# Altium schematic sheet Chua.SchDoc
size A4; SheetNumber: 2; SheetTotal: 9
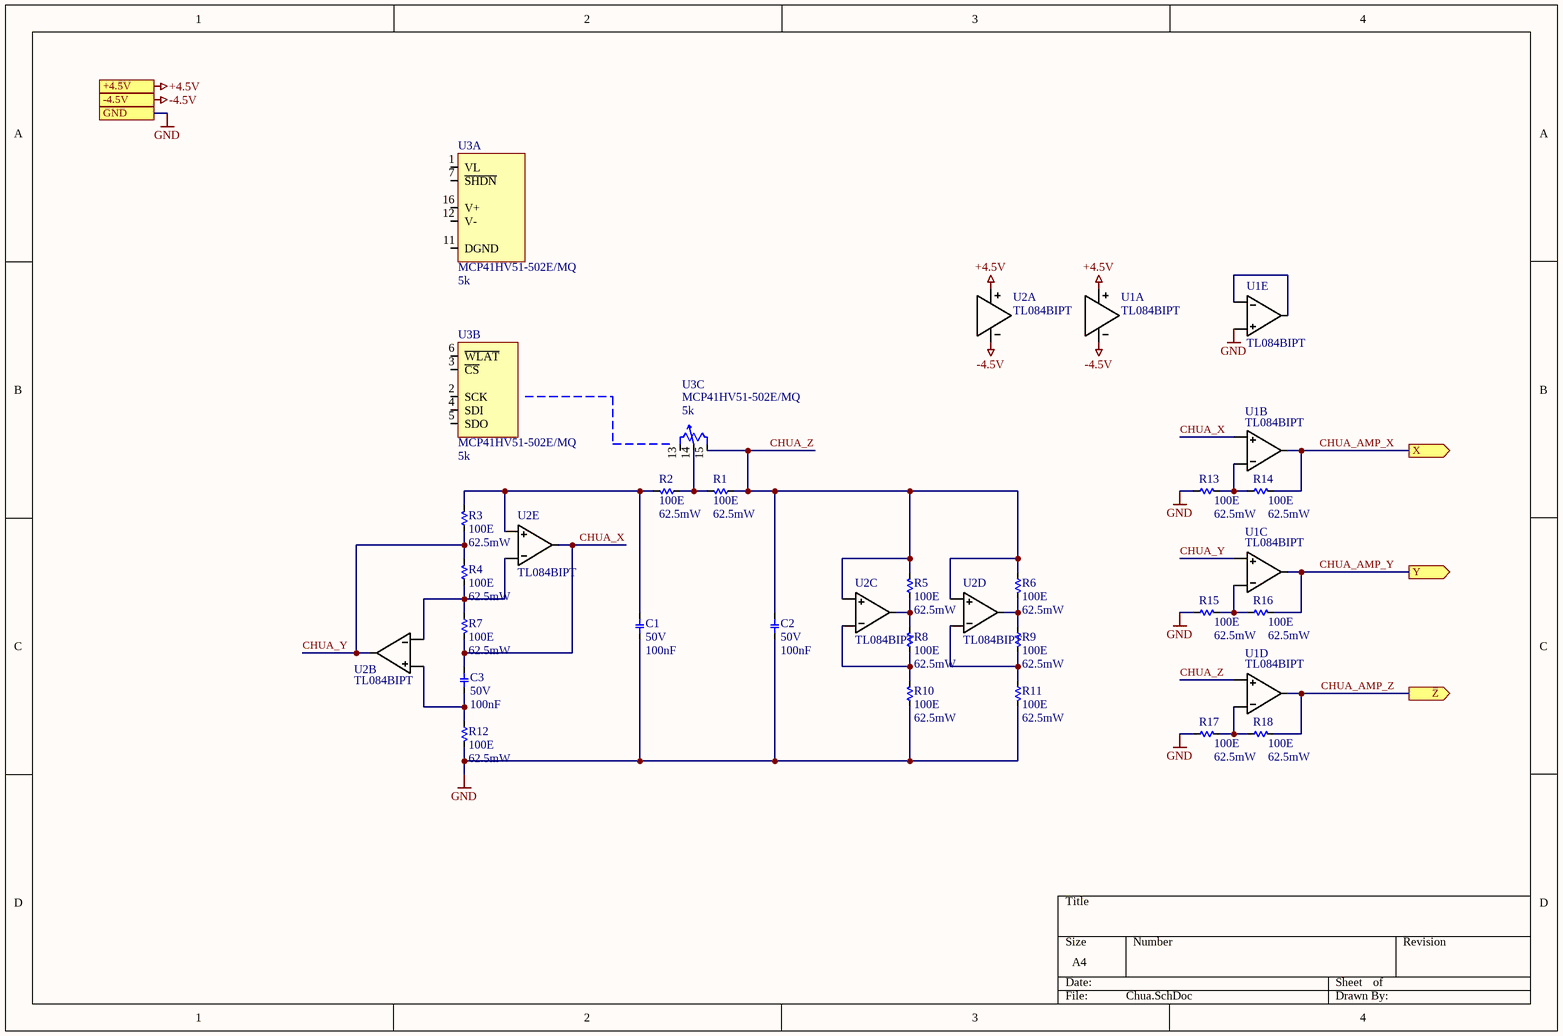
[diagram p0: Chua.SchDoc]

## Parts
C1  value 100nF  Value2: 50V  [CX7R0402C]  (hidden comment: 04025C104JAT2A)
C2  value 100nF  Value2: 50V  [CX7R0402C]  (hidden comment: 04025C104JAT2A)
C3  value 100nF  Value2: 50V  [CX7R0402C]  (hidden comment: 04025C104JAT2A)
R1  value 100E  Value2: 62.5mW  [RC0402]  (hidden comment: 0402FR-07100RL)
R2  value 100E  Value2: 62.5mW  [RC0402]  (hidden comment: 0402FR-07100RL)
R3  value 100E  Value2: 62.5mW  [RC0402]  (hidden comment: 0402FR-07100RL)
R4  value 100E  Value2: 62.5mW  [RC0402]  (hidden comment: 0402FR-07100RL)
R5  value 100E  Value2: 62.5mW  [RC0402]  (hidden comment: 0402FR-07100RL)
R6  value 100E  Value2: 62.5mW  [RC0402]  (hidden comment: 0402FR-07100RL)
R7  value 100E  Value2: 62.5mW  [RC0402]  (hidden comment: 0402FR-07100RL)
R8  value 100E  Value2: 62.5mW  [RC0402]  (hidden comment: 0402FR-07100RL)
R9  value 100E  Value2: 62.5mW  [RC0402]  (hidden comment: 0402FR-07100RL)
R10  value 100E  Value2: 62.5mW  [RC0402]  (hidden comment: 0402FR-07100RL)
R11  value 100E  Value2: 62.5mW  [RC0402]  (hidden comment: 0402FR-07100RL)
R12  value 100E  Value2: 62.5mW  [RC0402]  (hidden comment: 0402FR-07100RL)
R13  value 100E  Value2: 62.5mW  [RC0402]  (hidden comment: 0402FR-07100RL)
R14  value 100E  Value2: 62.5mW  [RC0402]  (hidden comment: 0402FR-07100RL)
R15  value 100E  Value2: 62.5mW  [RC0402]  (hidden comment: 0402FR-07100RL)
R16  value 100E  Value2: 62.5mW  [RC0402]  (hidden comment: 0402FR-07100RL)
R17  value 100E  Value2: 62.5mW  [RC0402]  (hidden comment: 0402FR-07100RL)
R18  value 100E  Value2: 62.5mW  [RC0402]  (hidden comment: 0402FR-07100RL)
U1  TL084BIPT  [TSSOP14_0.65_C]  (parts A,B,C,D,E of 5)
U2  TL084BIPT  [TSSOP14_0.65_C]  (parts A,B,C,D,E of 5)
U3  MCP41HV51-502E/MQ  value 5k  [QFN20_0.65_C]  (parts A,B,C of 3)

## Ports
+4.5V, -4.5V, GND, X (out), Y (out), Z (out)

## Nets
+4.5V: U1.4(VCC+) U2.4(VCC+) ; port +4.5V
-4.5V: U1.11(VCC-) U2.11(VCC-) ; port -4.5V
GND: C1.1 C2.1 R10.1 R11.1 R12.1 R13.2 R15.2 R17.2 U1.12(IN4+) ; port GND
CHUA_AMP_X: R14.1 U1.1(OUT1) ; port X
CHUA_AMP_Y: R16.1 U1.7(OUT2) ; port Y
CHUA_AMP_Z: R18.1 U1.8(OUT3) ; port Z
CHUA_X: C3.2 R7.1 U1.3(IN1+) U2.14(OUT4)
CHUA_Y: R3.2 R4.1 U1.5(IN2+) U2.1(OUT1)
CHUA_Z: C2.2 R1.1 R5.2 R6.2 U1.10(IN3+) U2.5(IN2+) U2.10(IN3+) U3.15(P0A)
NetC1_2: C1.2 R2.2 R3.1 U2.12(IN4+)
NetC3_1: C3.1 R12.2 U2.3(IN1+)
NetR1_2: R1.2 R2.1 U3.14(P0W)
NetR4_2: R4.2 R7.2 U2.2(IN1-) U2.13(IN4-)
NetR5_1: R5.1 R8.2 U2.7(OUT2)
NetR6_1: R6.1 R9.2 U2.8(OUT3)
NetR8_1: R8.1 R10.2 U2.6(IN2-)
NetR9_1: R9.1 R11.2 U2.9(IN3-)
NetR13_1: R13.1 R14.2 U1.2(IN1-)
NetR15_1: R15.1 R16.2 U1.6(IN2-)
NetR17_1: R17.1 R18.2 U1.9(IN3-)
NetU1_13: U1.13(IN4-) U1.14(OUT4)

Not connected (* = marked no-connect by the designer): U3 1(VL) 2(SCK) 3(~{CS}) 4(SDI) 5(SDO) 6(~{WLAT}) 7(~{SHDN}) 11(DGND) 12(V-) 13(P0B) 16(V+)

## Library data of the parts
C1-C3 = kyocera-C-X7R-0402: SMD Capacitor; CapacitanceCode: 104; VoltageCode: 5; Dielectric: C; ToleranceCode: J; MaxThicknessCode: E; Size: 0402
R1-R18 = YAGEO-RC-0402: SMD Resistor; TapingReelAndPower: 07; DefaultCode: L; ToleranceCode: F; ResistanceCode: 100R; PackagingTypeCode: R; Size: 0402; TemperatureCoefficientCode: -
U1 U2 = TL084: J-FET Amplifier 4 Circuit - 14-TSSOP; Type: TL084BIPT
U3 = MCP41HV51-502E/MQ: Digital Potentiometer 5k Ohm 1 Circuit 256 Taps SPI Interface 20-VQFN (5x5); Type: MCP41HV51-502E/MQ; Supplier 1: Digi-Key; Supplier Part Number 1: MCP41HV51-502E/MQ-ND